# EAGLE design Groupie (EAGLE 9.6.2)
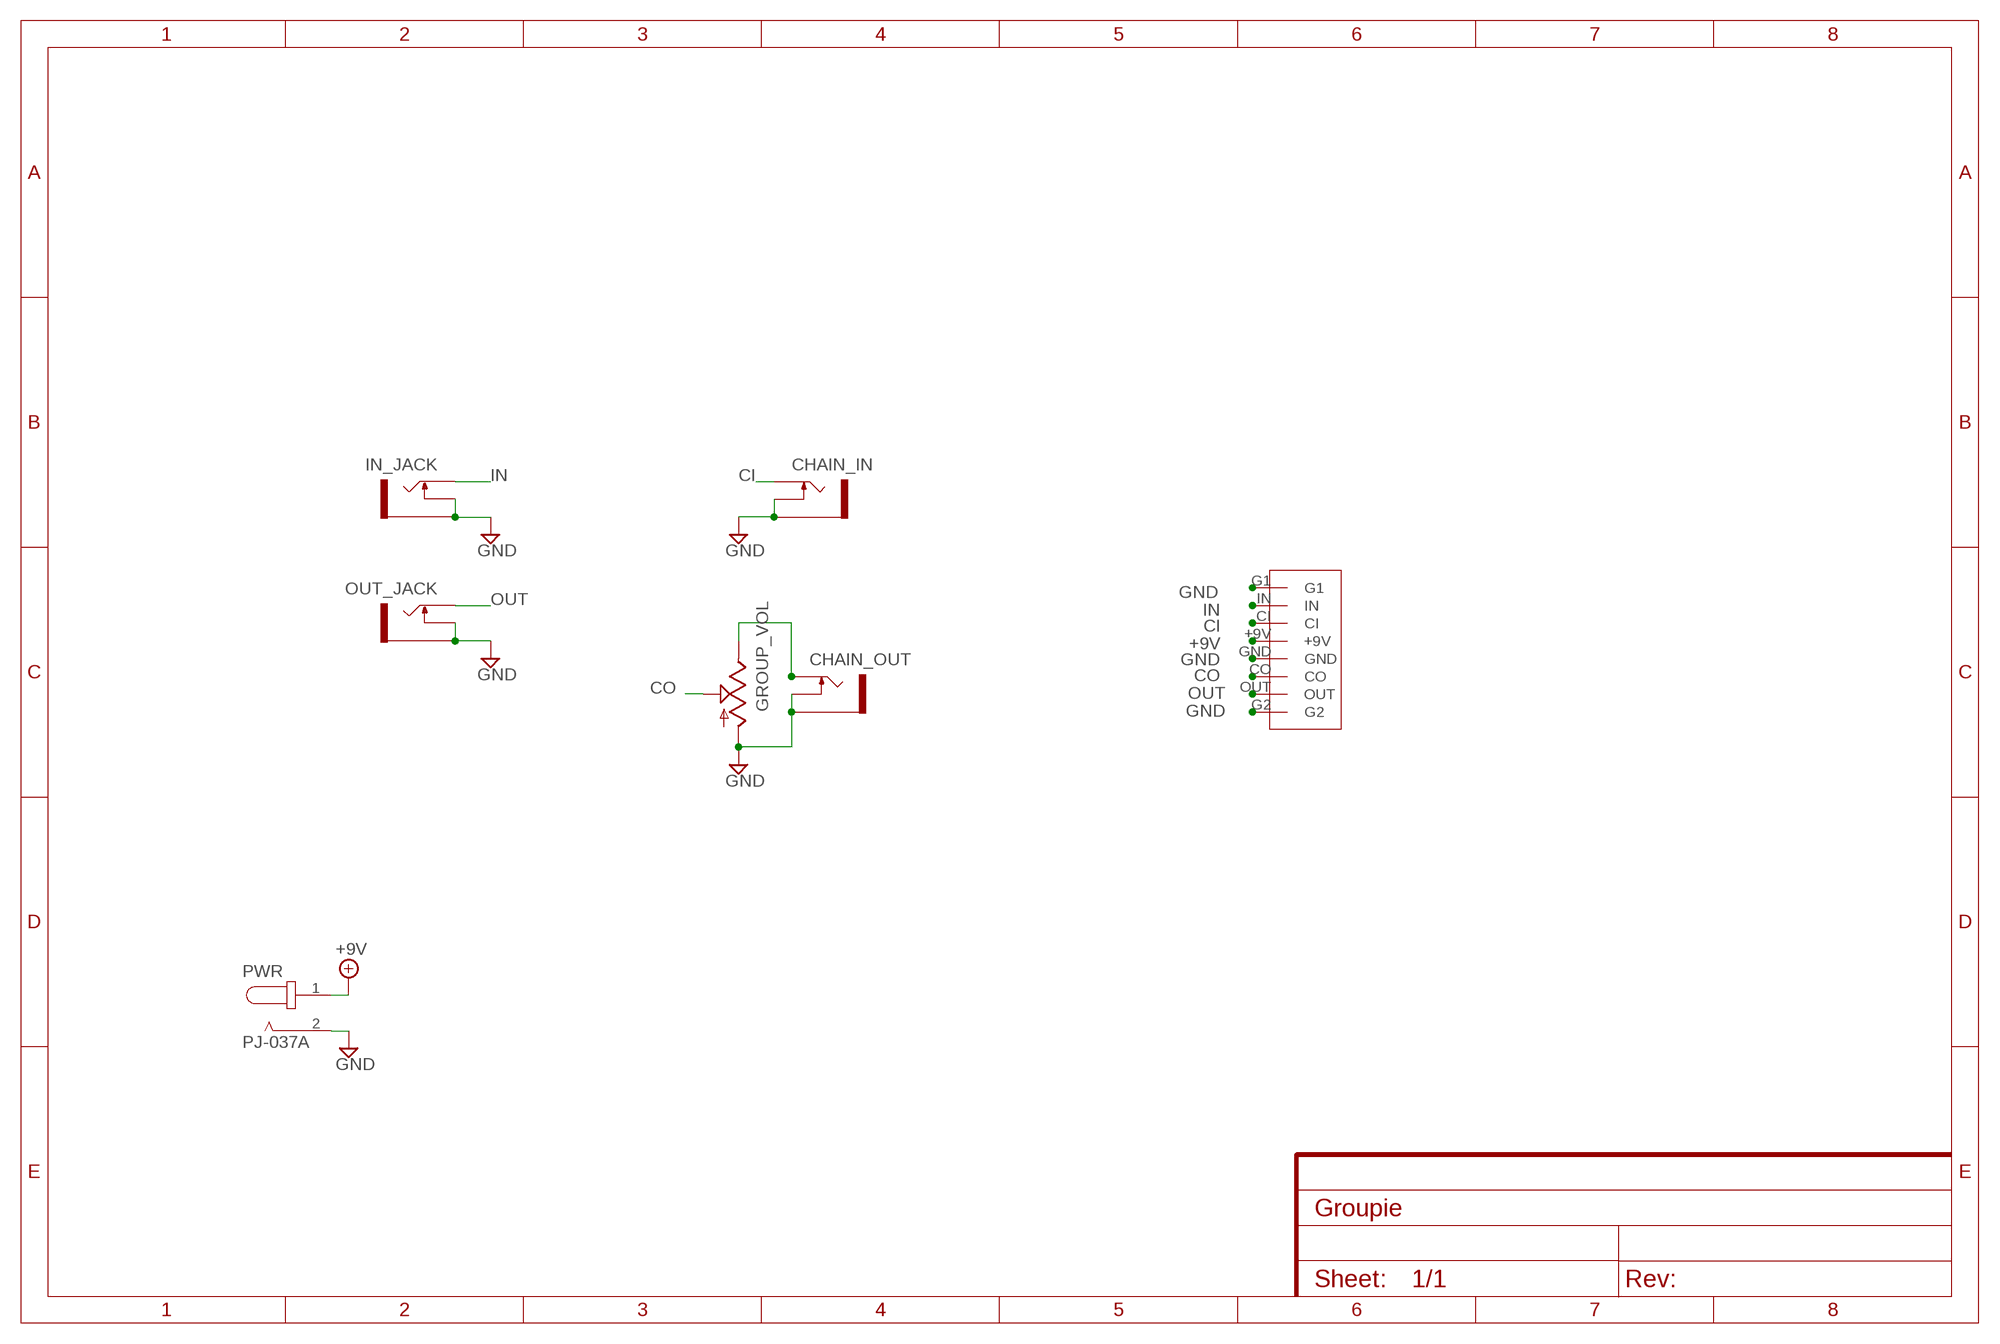
[diagram p0: schematic, sheet 1]

## Parts
CHAIN_IN  THONKICONNNEW  [WQP-PJ301M-12_JACK]
CHAIN_OUT  THONKICONNNEW  [WQP-PJ301M-12_JACK]
GROUP_VOL  9MM_SNAP-IN_POT_  [9MM_SNAP-IN_POT]
HEADERS  HEADERS8  [HEADERS8]
IN_JACK  THONKICONNNEW  [WQP-PJ301M-12_JACK]
OUT_JACK  THONKICONNNEW  [WQP-PJ301M-12_JACK]
PWR  PJ-037A  [CUI_PJ-037A]

## Nets
+9V: HEADERS.+9V PWR.1
CI: CHAIN_IN.P$1_TIP(TIP) HEADERS.CI
CO: GROUP_VOL.2(S) HEADERS.CO
GND: CHAIN_IN.P$2_SWITCH(SWITCH) CHAIN_IN.P$3_SLEEVE(SLEEVE) CHAIN_OUT.P$2_SWITCH(SWITCH) CHAIN_OUT.P$3_SLEEVE(SLEEVE) GROUP_VOL.1(A) HEADERS.G1 HEADERS.G2 HEADERS.GND IN_JACK.P$2_SWITCH(SWITCH) IN_JACK.P$3_SLEEVE(SLEEVE) OUT_JACK.P$2_SWITCH(SWITCH) OUT_JACK.P$3_SLEEVE(SLEEVE) PWR.2
IN: HEADERS.IN IN_JACK.P$1_TIP(TIP)
N$8: CHAIN_OUT.P$1_TIP(TIP) GROUP_VOL.3(E)
OUT: HEADERS.OUT OUT_JACK.P$1_TIP(TIP)

## Library data of the parts
CHAIN_IN CHAIN_OUT IN_JACK OUT_JACK = MusicThingModular:THONKICONN: 3.5mm socket for Eurorack modular synths
GROUP_VOL = MusicThingModular:9MM_SNAP-IN_POT: 9mm vertical snap-in pot, Alpha / Panasonic style
HEADERS = my_headers:HEADERS8
PWR = Power Socket PJ-037A:PJ-037A: 2.0 mm Center Pin, 2.5 A, Right Angle, Through Hole, Dc Power Jack Connector; AVAILABILITY: Unavailable; CUI_PURCHASE_URL: https://www.cuidevices.com/product/interconnect/connectors/dc-power-connectors/jacks/pj-037a?utm_source=snapeda.com&utm_medium=referral&utm_campaign=snapedaBOM; DESCRIPTION: 2.0 x 6.5 mm, 2.5 A, Horizontal, Through Hole, Dc Power Jack Connector; MF: CUI Devices; MP: PJ-037A; PACKAGE: None; PRICE: None

## Board
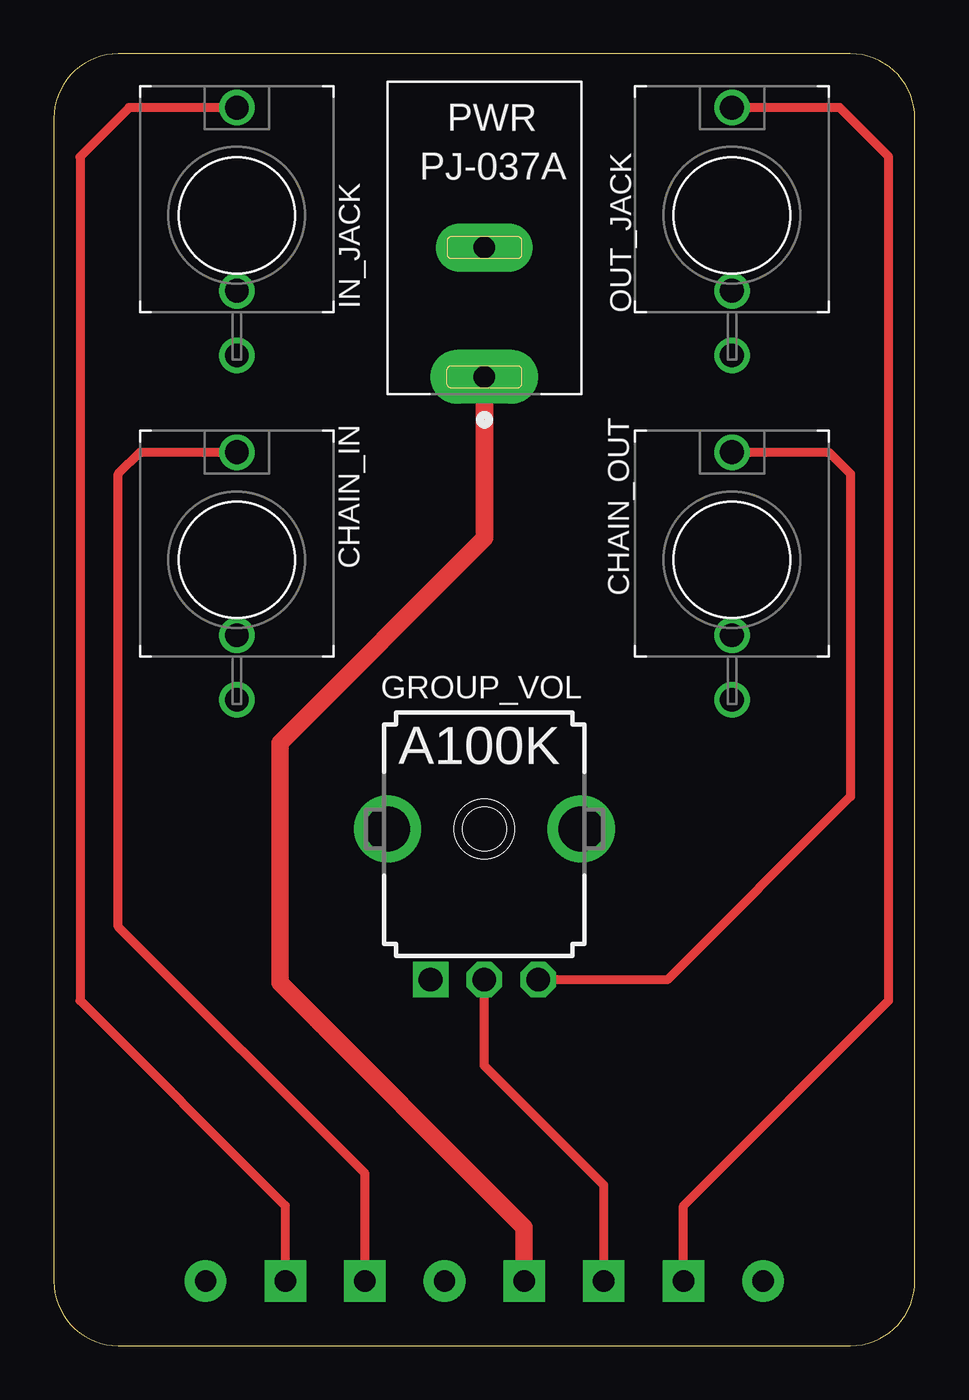
[diagram p1: board, top side]
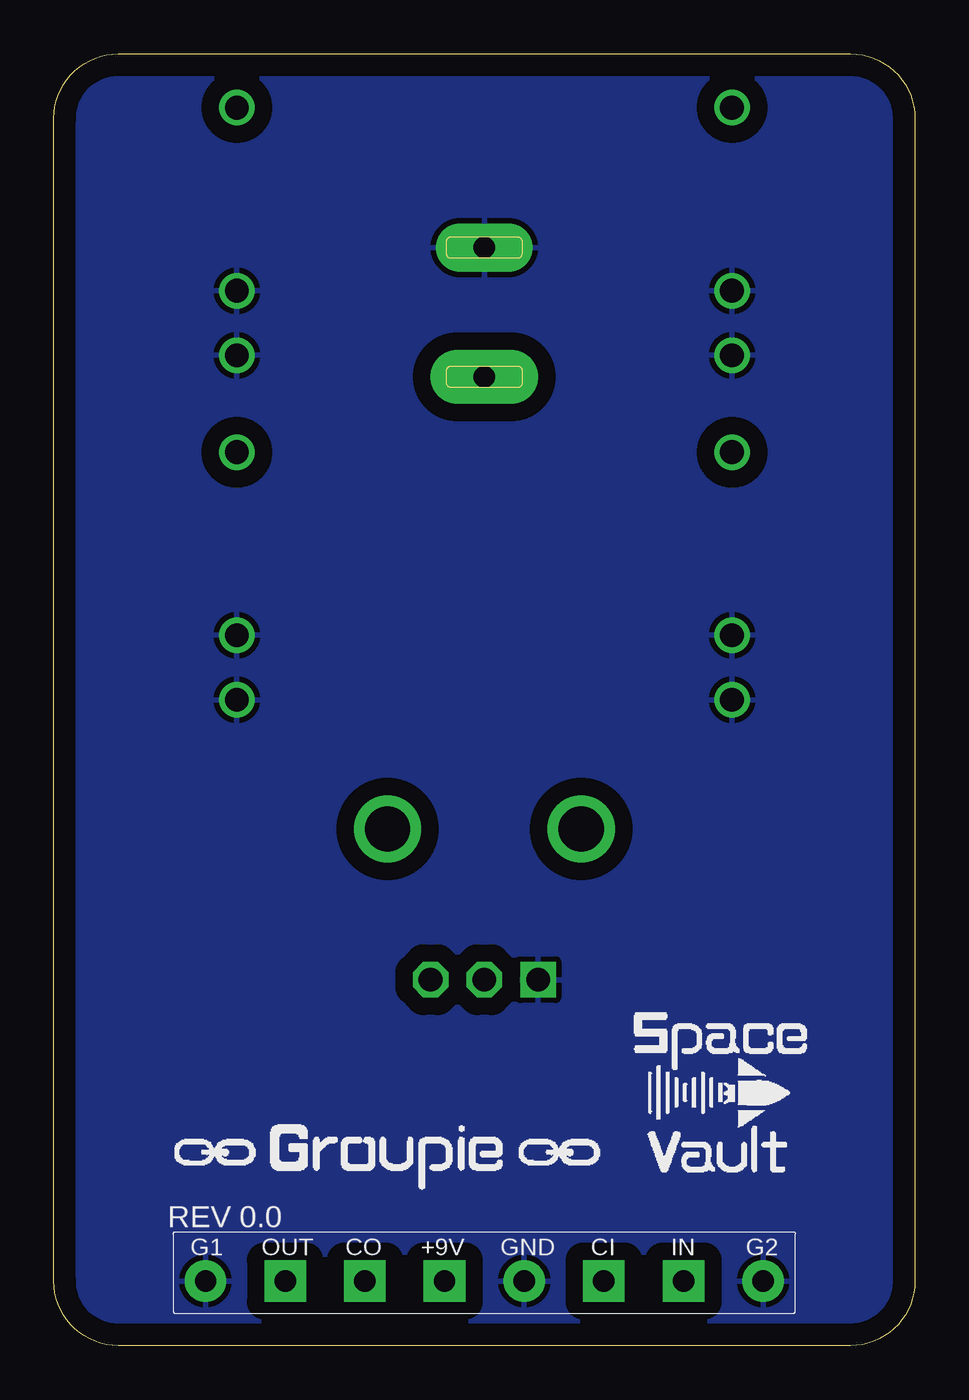
[diagram p2: board, bottom side, seen from below]

Size 40 x 60 mm. Coordinates in mm from the lower left corner, seen from the top.
Outline: 0,3 arc90 3,0 37,0 arc90 40,3 40,57 arc90 37,60 3,60 arc90 0,57 0,3
Copper layers (1*16): Top 0.035mm / dielectric 1.5mm / Bottom 0.035mm
Design rules "default": minimum track width 6mil, minimum drill 0.35mm, track to track 6mil, track to pad 6mil, pad to pad 6mil, via to via 6mil, smd to smd 6mil, copper to edge 40mil, drill to drill 6mil, minimum pad ring 10mil, minimum via ring 8mil, stop-mask expansion 4mil, vias tented up to drill 0mil, thermal gap 10mil

### Footprints (pad centres in the part's own frame; a part is rotated, then mirrored left to right if it is on the bottom)
WQP-PJ301M-12_JACK = drill 1.1: P$1_TIP 0,5; P$2_SWITCH 0,-3.5; P$3_SLEEVE 0,-6.5
9MM_SNAP-IN_POT = drill 1.1 square: 1 -2.5,-7 | drill 1.1 octagon: 2 0,-7; 3 2.5,-7 | drill 2.1 pad 2.794: CHASSIS1 -4.5,0; CHASSIS2 4.5,0
HEADERS8 = drill 0.991 pad 1.93 square: +9V -1.85,0; CI 5.55,0; CO -5.55,0; IN 9.25,0; OUT -9.25,0 | drill 0.991 pad 1.93: G1 -12.95,0; G2 12.95,0; GND 1.85,0
CUI_PJ-037A = drill 1 pad 2.5 long: 1 0,0 | drill 1 pad 2.25 long: 2 6,0

### Placement (x,y rotation side)
CHAIN_IN  8.5,36.5 0 top
CHAIN_OUT  31.5,36.5 0 top
GROUP_VOL  20,24 0 top
HEADERS  20,3 0 bottom
IN_JACK  8.5,52.5 0 top
OUT_JACK  31.5,52.5 0 top
PWR  20,45 90 top

### Tracks (layer width: path | path; a pad name or v marks a point on that pad's centre or on a via)
+9V
  Top 0.813: PWR.1 20,37.5 10.5,28 10.5,16.85 21.85,5.5 HEADERS.+9V
CI
  Top 0.406: HEADERS.CI 14.45,8 3,19.45 3,40.5 4,41.5 CHAIN_IN.P$1_TIP
CO
  Top 0.406: HEADERS.CO 25.55,7.45 20,13 GROUP_VOL.2
GND
  pour Bottom (isolate 0.813): 0.5,2.5 0.5,56.5 arc-90 3.5,59.5 36.5,59.5 arc-90 39.5,56.5 39.5,3.5 arc-90 36.5,0.5 2.5,0.5 arc-90
IN
  Top 0.406: IN_JACK.P$1_TIP 3.5,57.5 1.22,55.22 1.22,16.03 10.75,6.5 HEADERS.IN
N$8
  Top 0.406: CHAIN_OUT.P$1_TIP 36,41.5 37,40.5 37,25.5 28.5,17 GROUP_VOL.3
OUT
  Top 0.406: HEADERS.OUT 29.25,6.5 38.78,16.03 38.78,55.22 36.5,57.5 OUT_JACK.P$1_TIP

### Text on the board
bPlace: REV 0.0
tNames: A100K